# EAGLE design CE-01-02-04_v01 (EAGLE 5.10)
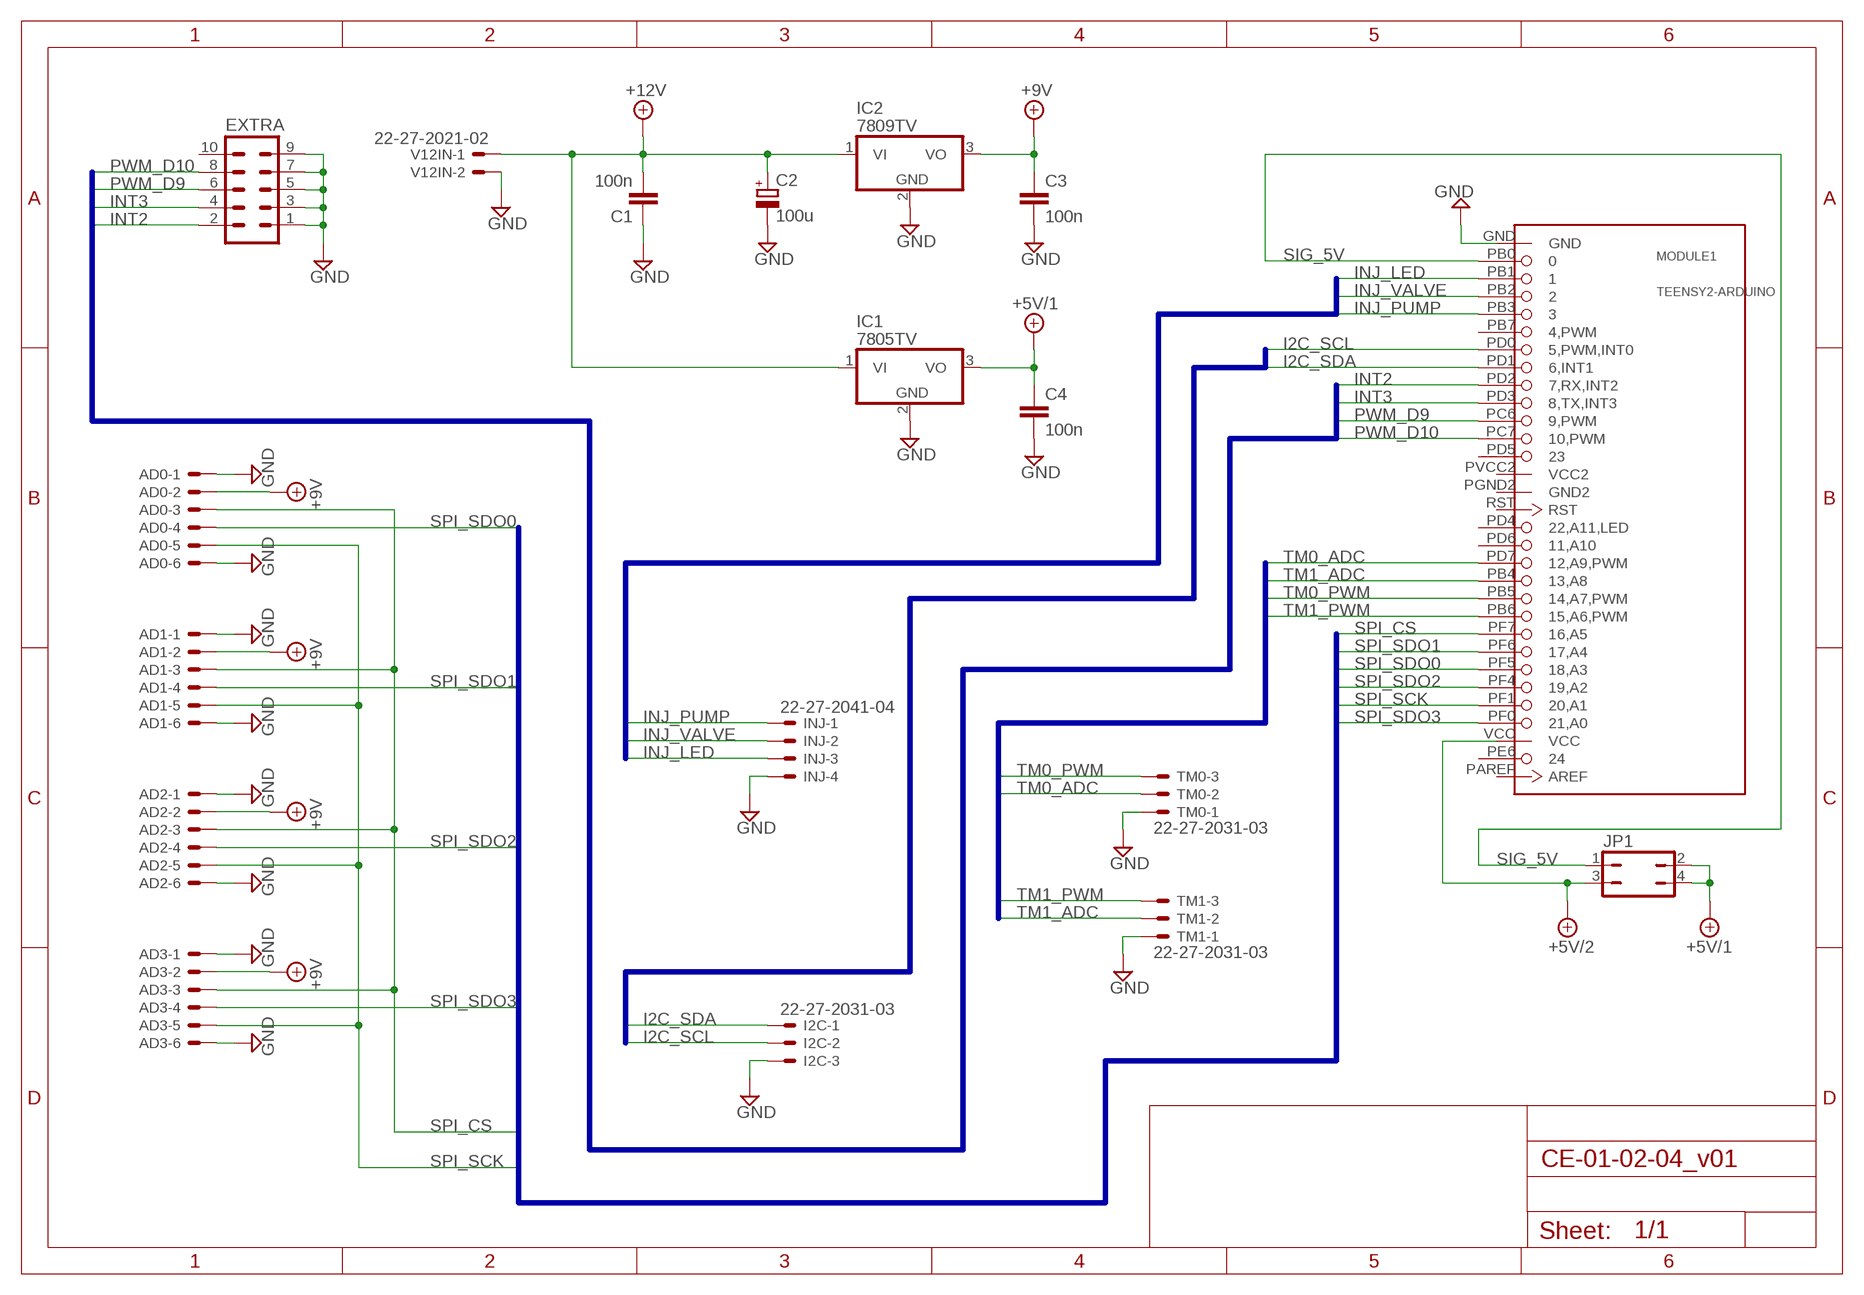
[diagram p0: schematic, sheet 1]

## Parts
AD0  22-27-2061-06  [6410-06]
AD1  22-27-2061-06  [6410-06]
AD2  22-27-2061-06  [6410-06]
AD3  22-27-2061-06  [6410-06]
C1  100n  C-EU050-025X075  [C050-025X075]
C2  100u  CPOL-EUE3.5-8  [E3,5-8]
C3  100n  C-EU050-025X075  [C050-025X075]
C4  100n  C-EU050-025X075  [C050-025X075]
EXTRA  ML10  [ML10]
I2C  22-27-2031-03  [6410-03]
IC1  7805TV  [TO220V]
IC2  7809TV  7812TV  [TO220V]
INJ  22-27-2041-04  [6410-04]
JP1  JP2Q  [JP2Q]
MODULE1  TEENSY2-ARDUINO  [TEENSY2]
TM0  22-27-2031-03  [6410-03]
TM1  22-27-2031-03  [6410-03]
V12IN  22-27-2021-02  [6410-02]

## Nets
+5V/1: C4.1 IC1.3(VO) JP1.2 JP1.4
+5V/2: JP1.3 MODULE1.VCC
+9V: AD0.2 AD1.2 AD2.2 AD3.2 C3.1 IC2.3(VO)
+12V: C1.2 C2.+ IC1.1(VI) IC2.1(VI) V12IN.1
GND: AD0.1 AD0.6 AD1.1 AD1.6 AD2.1 AD2.6 AD3.1 AD3.6 C1.1 C2.- C3.2 C4.2 EXTRA.1 EXTRA.3 EXTRA.5 EXTRA.7 EXTRA.9 I2C.3 IC1.2(GND) IC2.2(GND) INJ.4 MODULE1.GND TM0.1 TM1.1 V12IN.2
I2C_SCL: I2C.2 MODULE1.PD0(5,PWM,INT0)
I2C_SDA: I2C.1 MODULE1.PD1(6,INT1)
INJ_LED: INJ.3 MODULE1.PB1
INJ_PUMP: INJ.1 MODULE1.PB3
INJ_VALVE: INJ.2 MODULE1.PB2
INT2: EXTRA.2 MODULE1.PD2(7,RX,INT2)
INT3: EXTRA.4 MODULE1.PD3(8,TX,INT3)
PWM_D9: EXTRA.6 MODULE1.PC6(9,PWM)
PWM_D10: EXTRA.8 MODULE1.PC7(10,PWM)
SIG_5V: JP1.1 MODULE1.PB0
SPI_CS: AD0.3 AD1.3 AD2.3 AD3.3 MODULE1.PF7(16,A5)
SPI_SCK: AD0.5 AD1.5 AD2.5 AD3.5 MODULE1.PF1(20,A1)
SPI_SDO0: AD0.4 MODULE1.PF5(18,A3)
SPI_SDO1: AD1.4 MODULE1.PF6(17,A4)
SPI_SDO2: AD2.4 MODULE1.PF4(19,A2)
SPI_SDO3: AD3.4 MODULE1.PF0(21,A0)
TM0_ADC: MODULE1.PD7(12,A9,PWM) TM0.2
TM0_PWM: MODULE1.PB5(14,A7,PWM) TM0.3
TM1_ADC: MODULE1.PB4(13,A8) TM1.2
TM1_PWM: MODULE1.PB6(15,A6,PWM) TM1.3
Unconnected: EXTRA.10 MODULE1.PAREF(AREF) MODULE1.PB7(4,PWM) MODULE1.PD4(22,A11,LED) MODULE1.PD5 MODULE1.PD6(11,A10) MODULE1.PE6 MODULE1.RST

## Buses
B$1
B$2
B$3
B$4
B$5

## Power pins joined to a net without a drawn wire
GND2: MODULE1.PGND2(GND2)
VCC2: MODULE1.PVCC2(VCC2)

## Library data of the parts
AD0 AD1-AD3 = con-molex:22-?-06: CONNECTOR wire to board 2.54 mm (.1 inch) pitch header
C1 C3 C4 = rcl:C-EU: CAPACITOR, European symbol
C2 = rcl:CPOL-EU: POLARIZED CAPACITOR, European symbol
EXTRA = con-ml:ML10: HARTING
I2C TM0 TM1 = con-molex:22-?-03: CONNECTOR wire to board 2.54 mm (.1 inch) pitch header
IC1 IC2 = linear:78*: Positive VOLTAGE REGULATOR Source: http://cache.national.com/ds/LM/LM78L05.pdf http://www.fairchildsemi.com/ds/LM/LM7805.pdf
INJ = con-molex:22-?-04: CONNECTOR wire to board 2.54 mm (.1 inch) pitch header
JP1 = jumper:JP2Q: JUMPER
MODULE1 = teensy2:TEENSY2-ARDUINO
V12IN = con-molex:22-?-02: CONNECTOR wire to board 2.54 mm (.1 inch) pitch header

## Board
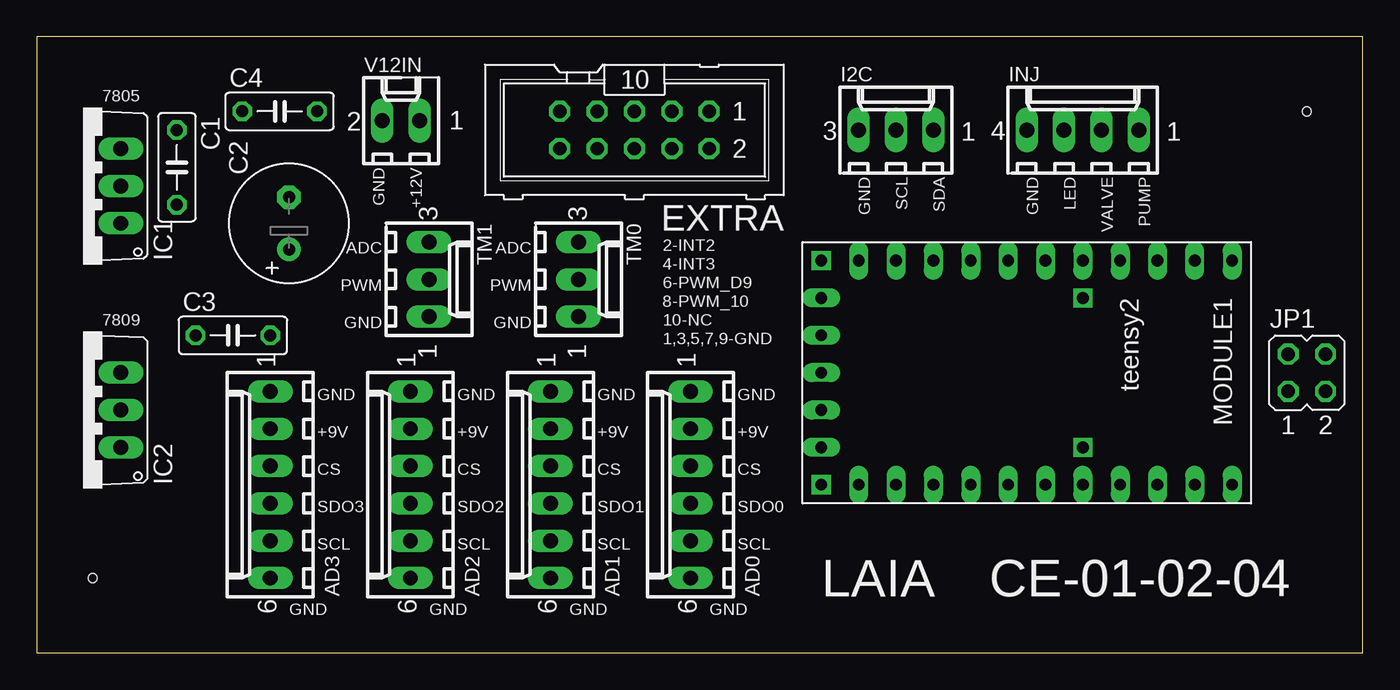
[diagram p1: board, top side]
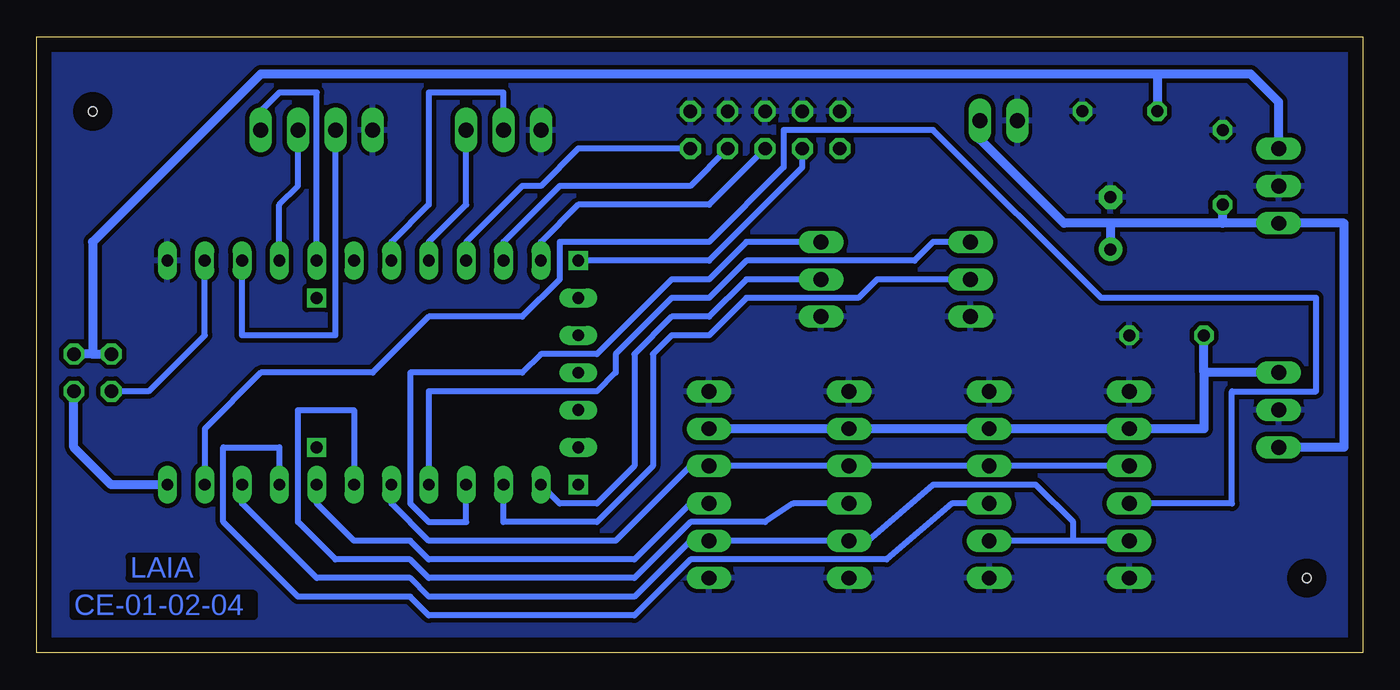
[diagram p2: board, bottom side, seen from below]

Size 90.16 x 41.9 mm. Coordinates in mm from the lower left corner, seen from the top.
Outline: 0,0 90.16,0 90.16,41.9 0,41.9 0,0
Copper layers (1*16): Top 0.035mm / dielectric 1.5mm / Bottom 0.035mm
Design rules "default": minimum track width 10mil, minimum drill 24mil, track to track 8mil, track to pad 8mil, pad to pad 8mil, via to via 8mil, smd to smd 8mil, copper to edge 40mil, drill to drill 8mil, minimum pad ring 10mil, minimum via ring 8mil, stop-mask expansion 4mil, vias tented up to drill 0mil, thermal gap 10mil
Holes 0.6 mm at 3.81,5.08 86.36,36.83

### Footprints (pad centres in the part's own frame; a part is rotated, then mirrored left to right if it is on the bottom)
6410-06 = drill 1.016 long: 1 6.35,0; 2 3.81,0; 3 1.27,0; 4 -1.27,0; 5 -3.81,0; 6 -6.35,0
C050-025X075 = drill 0.813 octagon: 1 -2.54,0; 2 2.54,0
E3,5-8 = drill 0.813 pad 1.6 round: + -1.778,0 | drill 0.813 pad 1.6 octagon: - 1.778,0
ML10 = drill 0.914 octagon: 1 -5.08,-1.27; 2 -5.08,1.27; 3 -2.54,-1.27; 4 -2.54,1.27; 5 0,-1.27; 6 0,1.27; 7 2.54,-1.27; 8 2.54,1.27; 9 5.08,-1.27; 10 5.08,1.27
6410-03 = drill 1.016 long: 1 2.54,0; 2 0,0; 3 -2.54,0
TO220V = drill 1.016 long: 1 -2.54,-2.54; 2 0,-2.54; 3 2.54,-2.54
6410-04 = drill 1.016 long: 1 3.81,0; 2 1.27,0; 3 -1.27,0; 4 -3.81,0
JP2Q = drill 0.914 octagon: 1 -1.27,-1.27; 2 -1.27,1.27; 3 1.27,-1.27; 4 1.27,1.27
TEENSY2 = drill 0.8 long: GND -7.62,15.24; PB0 -7.62,12.7; PB1 -7.62,10.16; PB2 -7.62,7.62; PB3 -7.62,5.08; PB4 7.62,-7.62; PB5 7.62,-5.08; PB6 7.62,-2.54; PB7 -7.62,2.54; PC6 -7.62,-10.16; PD0 -7.62,0; PD1 -7.62,-2.54; PD2 -7.62,-5.08; PD3 -7.62,-7.62; PD4 5.08,-12.7; PD5 -5.08,-12.7; PD7 7.62,-10.16; PF0 7.62,12.7; PF1 7.62,10.16; PF4 7.62,7.62; PF5 7.62,5.08; PF6 7.62,2.54; PF7 7.62,0; PGND2 0,-12.7; PVCC2 -2.54,-12.7; RST 2.54,-12.7; VCC 7.62,15.24 | drill 0.8 square: PAREF 5.08,5.08; PC7 -7.62,-12.7; PD6 7.62,-12.7; PE6 -5.08,5.08
6410-02 = drill 1.016 long: 1 1.27,0; 2 -1.27,0

### Placement (x,y rotation side)
AD0  44.45,11.43 90 top
AD1  34.92,11.43 90 top
AD2  25.4,11.43 90 top
AD3  15.88,11.43 90 top
C1  9.53,33.02 270 top
C2  17.14,29.21 90 top
C3  13.34,21.59 0 top
C4  16.51,36.83 0 top
EXTRA  40.64,35.56 180 top
I2C  58.42,35.56 0 top
IC1  3.17,31.75 90 top
IC2  3.17,16.51 90 top
INJ  71.12,35.56 0 top
JP1  86.36,19.05 0 top
MODULE1  66.04,19.05 270 top
TM0  36.83,25.4 270 top
TM1  26.67,25.4 270 top
V12IN  24.77,36.2 0 top

### Tracks (layer width: path | path; a pad name or v marks a point on that pad's centre or on a via)
+5V/1
  Bottom 0.254: IC1.3 6.35,34.29
  Bottom 0.61: 13.97,39.37 7.62,39.37 5.71,37.47 IC1.3 | 13.97,39.37 74.93,39.37 86.36,27.94 86.36,20.32 | 13.97,39.37 C4.1 | 86.36,20.32 JP1.2 | 86.36,20.32 JP1.4
+5V/2
  Bottom 0.61: MODULE1.VCC 85.09,11.43 87.63,13.97 JP1.3
+9V
  Bottom 0.61: AD0.2 AD1.2 AD2.2 AD3.2 10.79,15.24 10.79,19.05 | IC2.3 10.79,19.05 | 10.79,19.05 C3.1
+12V
  Bottom 0.61: V12IN.1 26.04,34.93 20.32,29.21 17.14,29.21 | 9.53,29.21 IC1.1 1.27,29.21 1.27,13.97 IC2.1 | 9.53,29.21 C1.2 | 9.53,29.21 17.14,29.21 | 17.14,29.21 C2.+
GND
  pour Bottom (isolate 0.305): 0,41.91 90.17,41.91 90.17,0 0,0
I2C_SCL
  Bottom 0.406: MODULE1.PD0 66.04,27.94 63.5,30.48 63.5,38.1 58.42,38.1 I2C.2
I2C_SDA
  Bottom 0.406: MODULE1.PD1 63.5,27.94 60.96,30.48 I2C.1
INJ_LED
  Bottom 0.406: MODULE1.PB1 76.2,21.59 69.85,21.59 INJ.3
INJ_PUMP
  Bottom 0.406: MODULE1.PB3 71.12,38.1 73.66,38.1 74.93,36.83 INJ.1
INJ_VALVE
  Bottom 0.406: MODULE1.PB2 73.66,30.48 72.39,31.75 72.39,33.02 INJ.2
INT2
  Bottom 0.406: MODULE1.PD2 60.96,27.94 57.15,31.75 55.88,31.75 53.34,34.29 EXTRA.2
INT3
  Bottom 0.406: MODULE1.PD3 58.42,27.94 54.61,31.75 45.72,31.75 EXTRA.4
PWM_D9
  Bottom 0.406: MODULE1.PC6 55.88,27.94 53.34,30.48 44.45,30.48 EXTRA.6
PWM_D10
  Bottom 0.406: MODULE1.PC7 44.45,26.67 38.1,33.02 EXTRA.8
SIG_5V
  Bottom 0.406: MODULE1.PB0 78.74,21.59 82.55,17.78 JP1.1
SPI_CS
  Bottom 0.254: AD0.3 45.72,12.7
  Bottom 0.406: AD3.3 AD2.3 AD1.3 AD0.3 | MODULE1.PF7 66.04,10.16 63.5,7.62 50.8,7.62 45.72,12.7
SPI_SCK
  Bottom 0.406: AD3.5 19.68,7.62 | 19.68,7.62 AD2.5 | MODULE1.PF1 76.2,10.16 71.12,5.08 64.77,5.08 63.5,3.81 49.53,3.81 45.72,7.62 AD0.5 AD1.5 33.66,7.62 29.21,11.43 22.23,11.43 19.68,8.89 19.68,7.62
SPI_SDO0
  Bottom 0.406: MODULE1.PF5 71.12,10.16 68.58,7.62 64.77,7.62 63.5,6.35 49.53,6.35 45.72,10.16 AD0.4
SPI_SDO1
  Bottom 0.406: MODULE1.PF6 68.58,16.51 72.39,16.51 72.39,8.89 69.85,6.35 64.77,6.35 63.5,5.08 49.53,5.08 45.72,8.89 40.64,8.89 38.73,10.16 AD1.4
SPI_SDO2
  Bottom 0.406: MODULE1.PF4 73.66,13.97 77.47,13.97 77.47,8.89 72.39,3.81 64.77,3.81 63.5,2.54 49.53,2.54 45.72,6.35 32.38,6.35 27.94,10.16 AD2.4
SPI_SDO3
  Bottom 0.406: MODULE1.PF0 78.74,15.24 74.93,19.05 67.31,19.05 63.5,22.86 57.15,22.86 54.61,25.4 54.61,27.94 44.45,27.94 39.37,33.02 39.37,35.56 29.21,35.56 17.78,24.13 3.17,24.13 3.17,17.78 8.89,17.78 8.89,10.16 AD3.4
TM0_ADC
  Bottom 0.406: MODULE1.PD7 54.61,10.16 52.07,10.16 49.53,12.7 49.53,20.32 46.99,22.86 44.45,22.86 41.91,25.4 TM0.2
TM0_PWM
  Bottom 0.406: MODULE1.PB5 60.96,8.89 63.5,8.89 64.77,10.16 64.77,19.05 57.15,19.05 55.88,20.32 52.07,20.32 46.99,25.4 44.45,25.4 41.91,27.94 TM0.3
TM1_ADC
  Bottom 0.406: MODULE1.PB4 58.42,8.89 52.07,8.89 48.26,12.7 48.26,20.32 46.99,21.59 44.45,21.59 41.91,24.13 34.29,24.13 33.02,25.4 TM1.2
TM1_PWM
  Bottom 0.406: MODULE1.PB6 63.5,17.78 52.07,17.78 50.8,19.05 50.8,20.32 46.99,24.13 44.45,24.13 41.91,26.67 30.48,26.67 29.21,27.94 TM1.3

### Text on the board
Bottom: LAIA | CE-01-02-04
tNames: 7805 | GND | +12V | GND | SCL | SDA | GND | LED | VALVE | PUMP | ADC | ADC | 2-INT2 | 4-INT3 | PWM | PWM | 6-PWM_D9 | GND | GND | 8-PWM_10 | 7809 | 10-NC | 1,3,5,7,9-GND | GND | GND | GND | GND | +9V | +9V | +9V | +9V | CS | CS | CS | CS | SDO3 | SDO2 | SDO1 | SDO0 | SCL | SCL | SCL | SCL | LAIA | CE-01-02-04 | GND | GND | GND | GND